# Altium schematic sheet buffer.SchDoc
size A
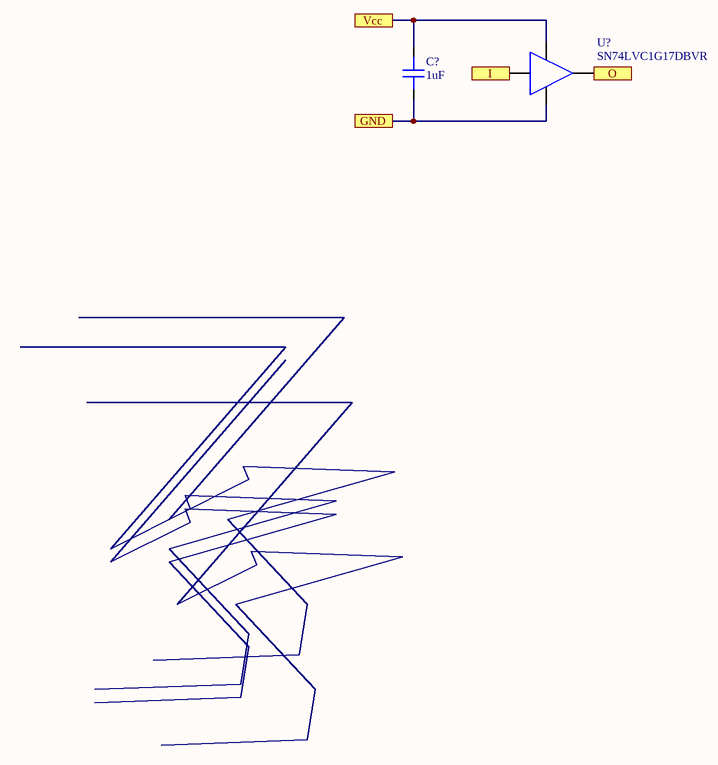
[diagram p0: buffer.SchDoc]

## Parts
C?  capacitance: 1uF  [0603]  (hidden comment: capacitor)
U?  SN74LVC1G17DBVR  [SOT23-5]

## Ports
GND, I (in), O (out), Vcc

## Nets
GND: C?.1 U?.3(GND) ; port GND
I: U?.2(A) ; port I
O: U?.4(Y) ; port O
Vcc: C?.2 U?.5(Vcc) ; port Vcc

## Library data of the parts
C? = 1: Generic 0603 capacitor; id: 1; voltage: 50; dielectric: Ceramic; percent tolerance: 10; name: 0603 Capacitor; ESR: 1; package: 0603; quantity: 0
U? = 12: Buffer, Non-Inverting 1 Element 1 Bit per Ele; id: 12; Vcc: 1V65 - 5V5; Name: SN74LVC1G17DBVR; type: Buffer - Schmidt; package: SOT-23-5; quantity: 0; link: https://www.digikey.com/product-detail/en/texas-instruments/SN74LVC1G17DBVR/296-11933-1-ND/389050